# EAGLE design proximity_pcb (EAGLE 5.10)
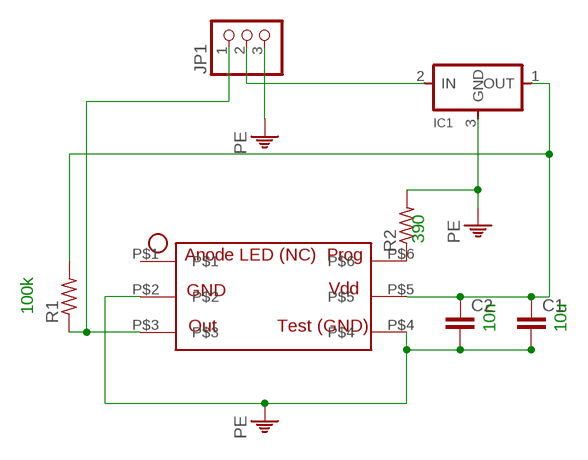
[diagram p0: schematic, sheet 1]

## Parts
C1  C-EUC0805  [C0805]
C2  C-EUC0805  [C0805]
IC1  REGULATORSOT23  [SOT23]
JP1  PINHD-1X3  [1X03]
R1  R-US_R0805  [R0805]
R2  R-US_R0805  [R0805]
U$1  SFH7741  [SFH7741-SMD]

## Nets
N$1: C1.1 C2.1 IC1.1(OUT) R1.2 U$1.P$5
N$2: IC1.2(IN) JP1.2
N$3: JP1.1 R1.1 U$1.P$3
N$4: R2.1 U$1.P$6
PE: C1.2 C2.2 IC1.3(GND) JP1.3 R2.2 U$1.P$2 U$1.P$4
Unconnected: U$1.P$1

## Notes on the sheet
- 390
- 100k
- 10n | 10u

## Library data of the parts
C1 C2 = rcl:C-EU: CAPACITOR, European symbol
IC1 = ng:REGULATOR
JP1 = pinhead:PINHD-1X3: PIN HEADER
R1 R2 = resistor:R-US_: RESISTOR, American symbol
U$1 = rfc:SFH7741: 3.6 V IR proximity sensor. SMD

## Board
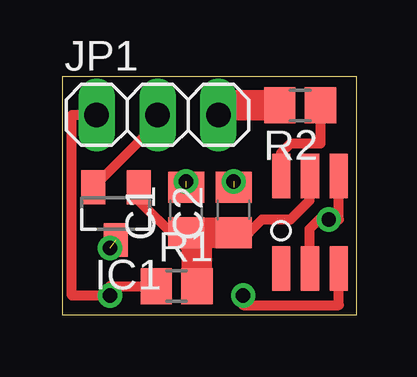
[diagram p1: board, top side]
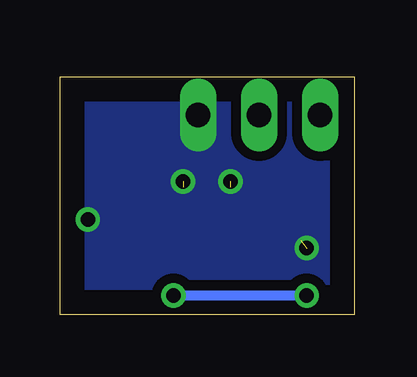
[diagram p2: board, bottom side, seen from below]

Size 12.26 x 9.92 mm. Coordinates in mm from the lower left corner, seen from the top.
Outline: 0,0 12.26,0 12.26,9.92 0,9.92 0,0
Copper layers (1*16): Top 0.035mm / dielectric 1.5mm / Bottom 0.035mm
Design rules "default *": minimum track width 10mil, minimum drill 24mil, track to track 16mil, track to pad 16mil, pad to pad 16mil, via to via 16mil, smd to smd 16mil, copper to edge 40mil, drill to drill 8mil, minimum pad ring 10mil, minimum via ring 8mil, stop-mask expansion 4mil, vias tented up to drill 0mil, thermal gap 10mil

### Footprints (pad centres in the part's own frame; a part is rotated, then mirrored left to right if it is on the bottom)
C0805 = smd 1.3 x 1.5: 1 -0.95,0; 2 0.95,0
SOT23 = smd 1 x 1.4: 1 -0.95,-1.1; 2 0.95,-1.1; 3 0,1.1
1X03 = drill 1.016 long: 1 -2.54,0; 2 0,0; 3 2.54,0
R0805 = smd 1.3 x 1.5: 1 -0.85,0; 2 0.85,0
SFH7741-SMD = smd 1.85 x 0.762: P$1 -0.3,0; P$2 -0.3,-1.2; P$3 -0.3,-2.4; P$4 3.55,-2.4; P$5 3.55,-1.2; P$6 3.55,0

### Placement (x,y rotation side)
C1  5.15,4.36 90 top
C2  7.13,4.36 90 top
IC1  2.23,4.21 180 top
JP1  3.96,8.32 0 top
R1  4.75,1.19 0 top
R2  9.91,8.72 180 top
U$1  9.11,2.23 90 top

### Tracks (layer width: path | path; a pad name or v marks a point on that pad's centre or on a via)
N$1
  Top 0.406: IC1.1 3.17,4.75 4.75,3.17 4.91,3.17 C1.1 | C2.1 7.77,3.41 8.32,3.96 9.51,3.96 | 9.51,3.96 | 9.51,3.96 10.3,4.75 10.3,5.76 U$1.P$5
  Top 1.27: C2.1 C1.1 5.61,2.96 R1.2
N$2
  Top 0.406: IC1.2 3.96,7.99 JP1.2
N$3  (via drill 0.6)
  Top 0.406: U$1.P$3 11.51,0.4 7.53,0.4 v7.53,0.79 | JP1.1 0.4,8.32 0.4,0.79 v1.98,0.79 1.98,1.19 R1.1 | JP1.1
  Bottom 0.406: v1.98,0.79 v7.53,0.79
N$4
  Top 0.406: U$1.P$6 9.11,6.74 9.51,7.13 10.76,7.13 R2.1
N$5  (via drill 0.6)
  other vias: 7.53,0.79
PE  (via drill 0.6)  (3 unrouted)
  Top 0.406: U$1.P$2 10.3,3.57 10.7,3.96 v11.1,3.96 11.51,3.96 U$1.P$4
  Top 1.27: R2.2 6.5,8.72 JP1.3
  other vias: 1.98,2.77 5.15,5.55 7.13,5.55
  pour Bottom (no thermals): 0,9.91 12.28,9.91 12.28,0 8.32,0 8.32,1.58 1.19,1.58 1.19,0 0,0